# Altium schematic sheet ESP32_DevBoard_B.SchDoc
size A4
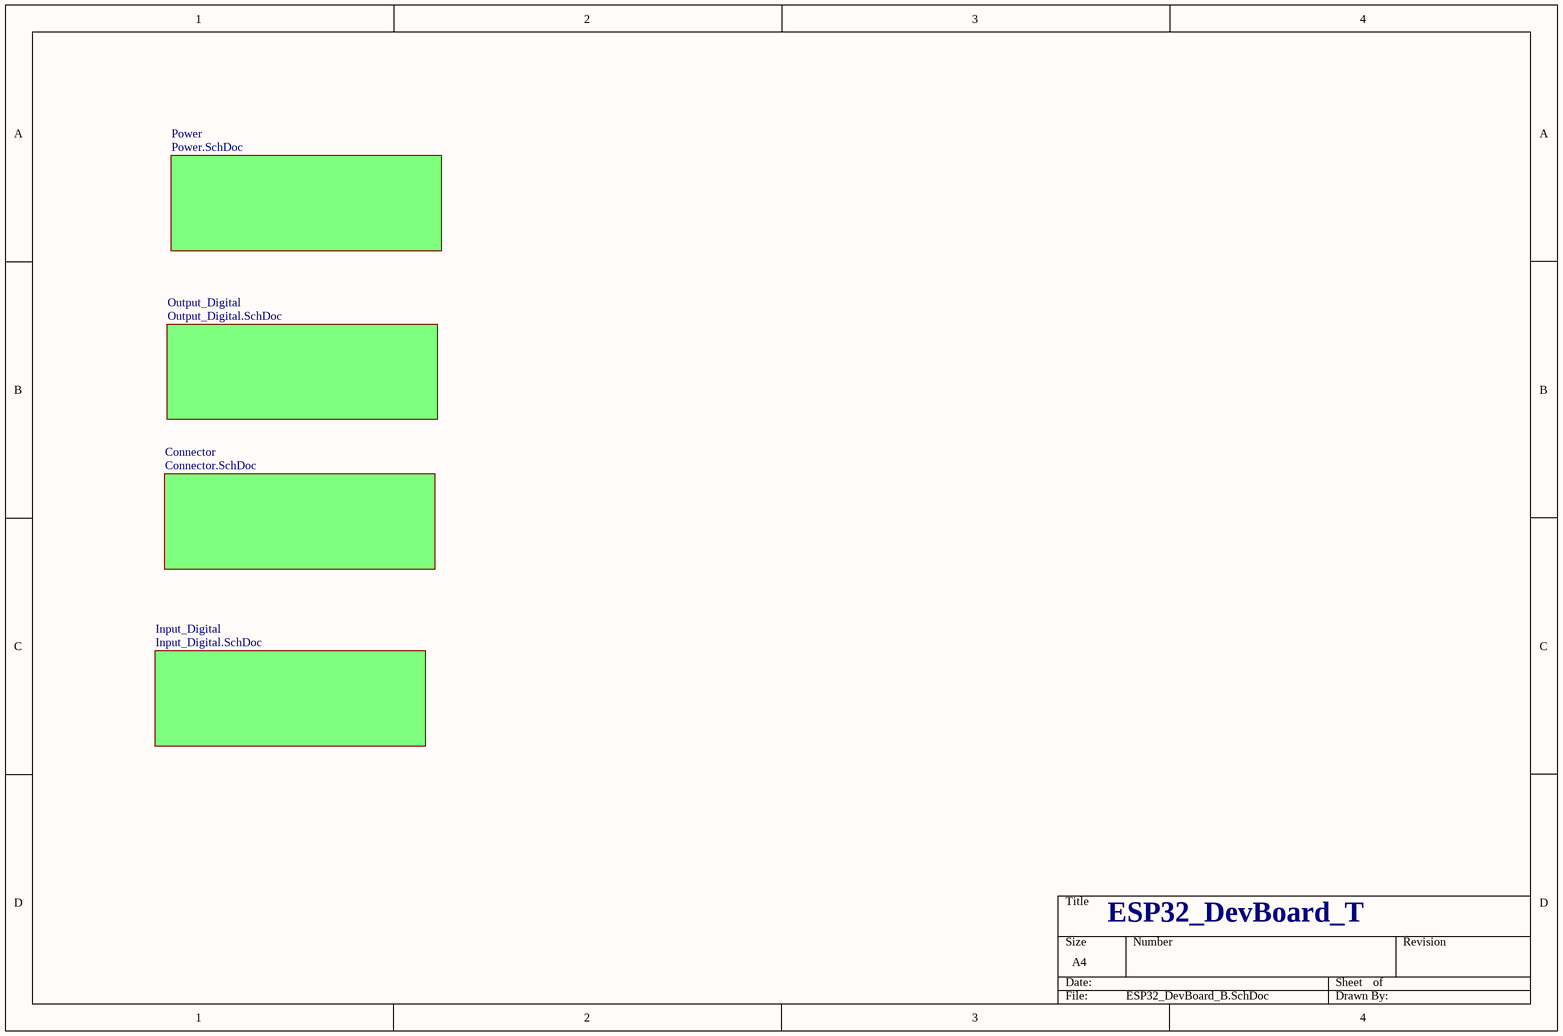
[diagram p0: ESP32_DevBoard_B.SchDoc]

## Sub-sheets
Connector = Connector.SchDoc: no entries
Input_Digital = Input_Digital.SchDoc: no entries
Output_Digital = Output_Digital.SchDoc: no entries
Power = Power.SchDoc: no entries

## Notes on the sheet
- ESP32_DevBoard_T